# Altium project 2019_10_ELEV_18_IO.PrjPCB
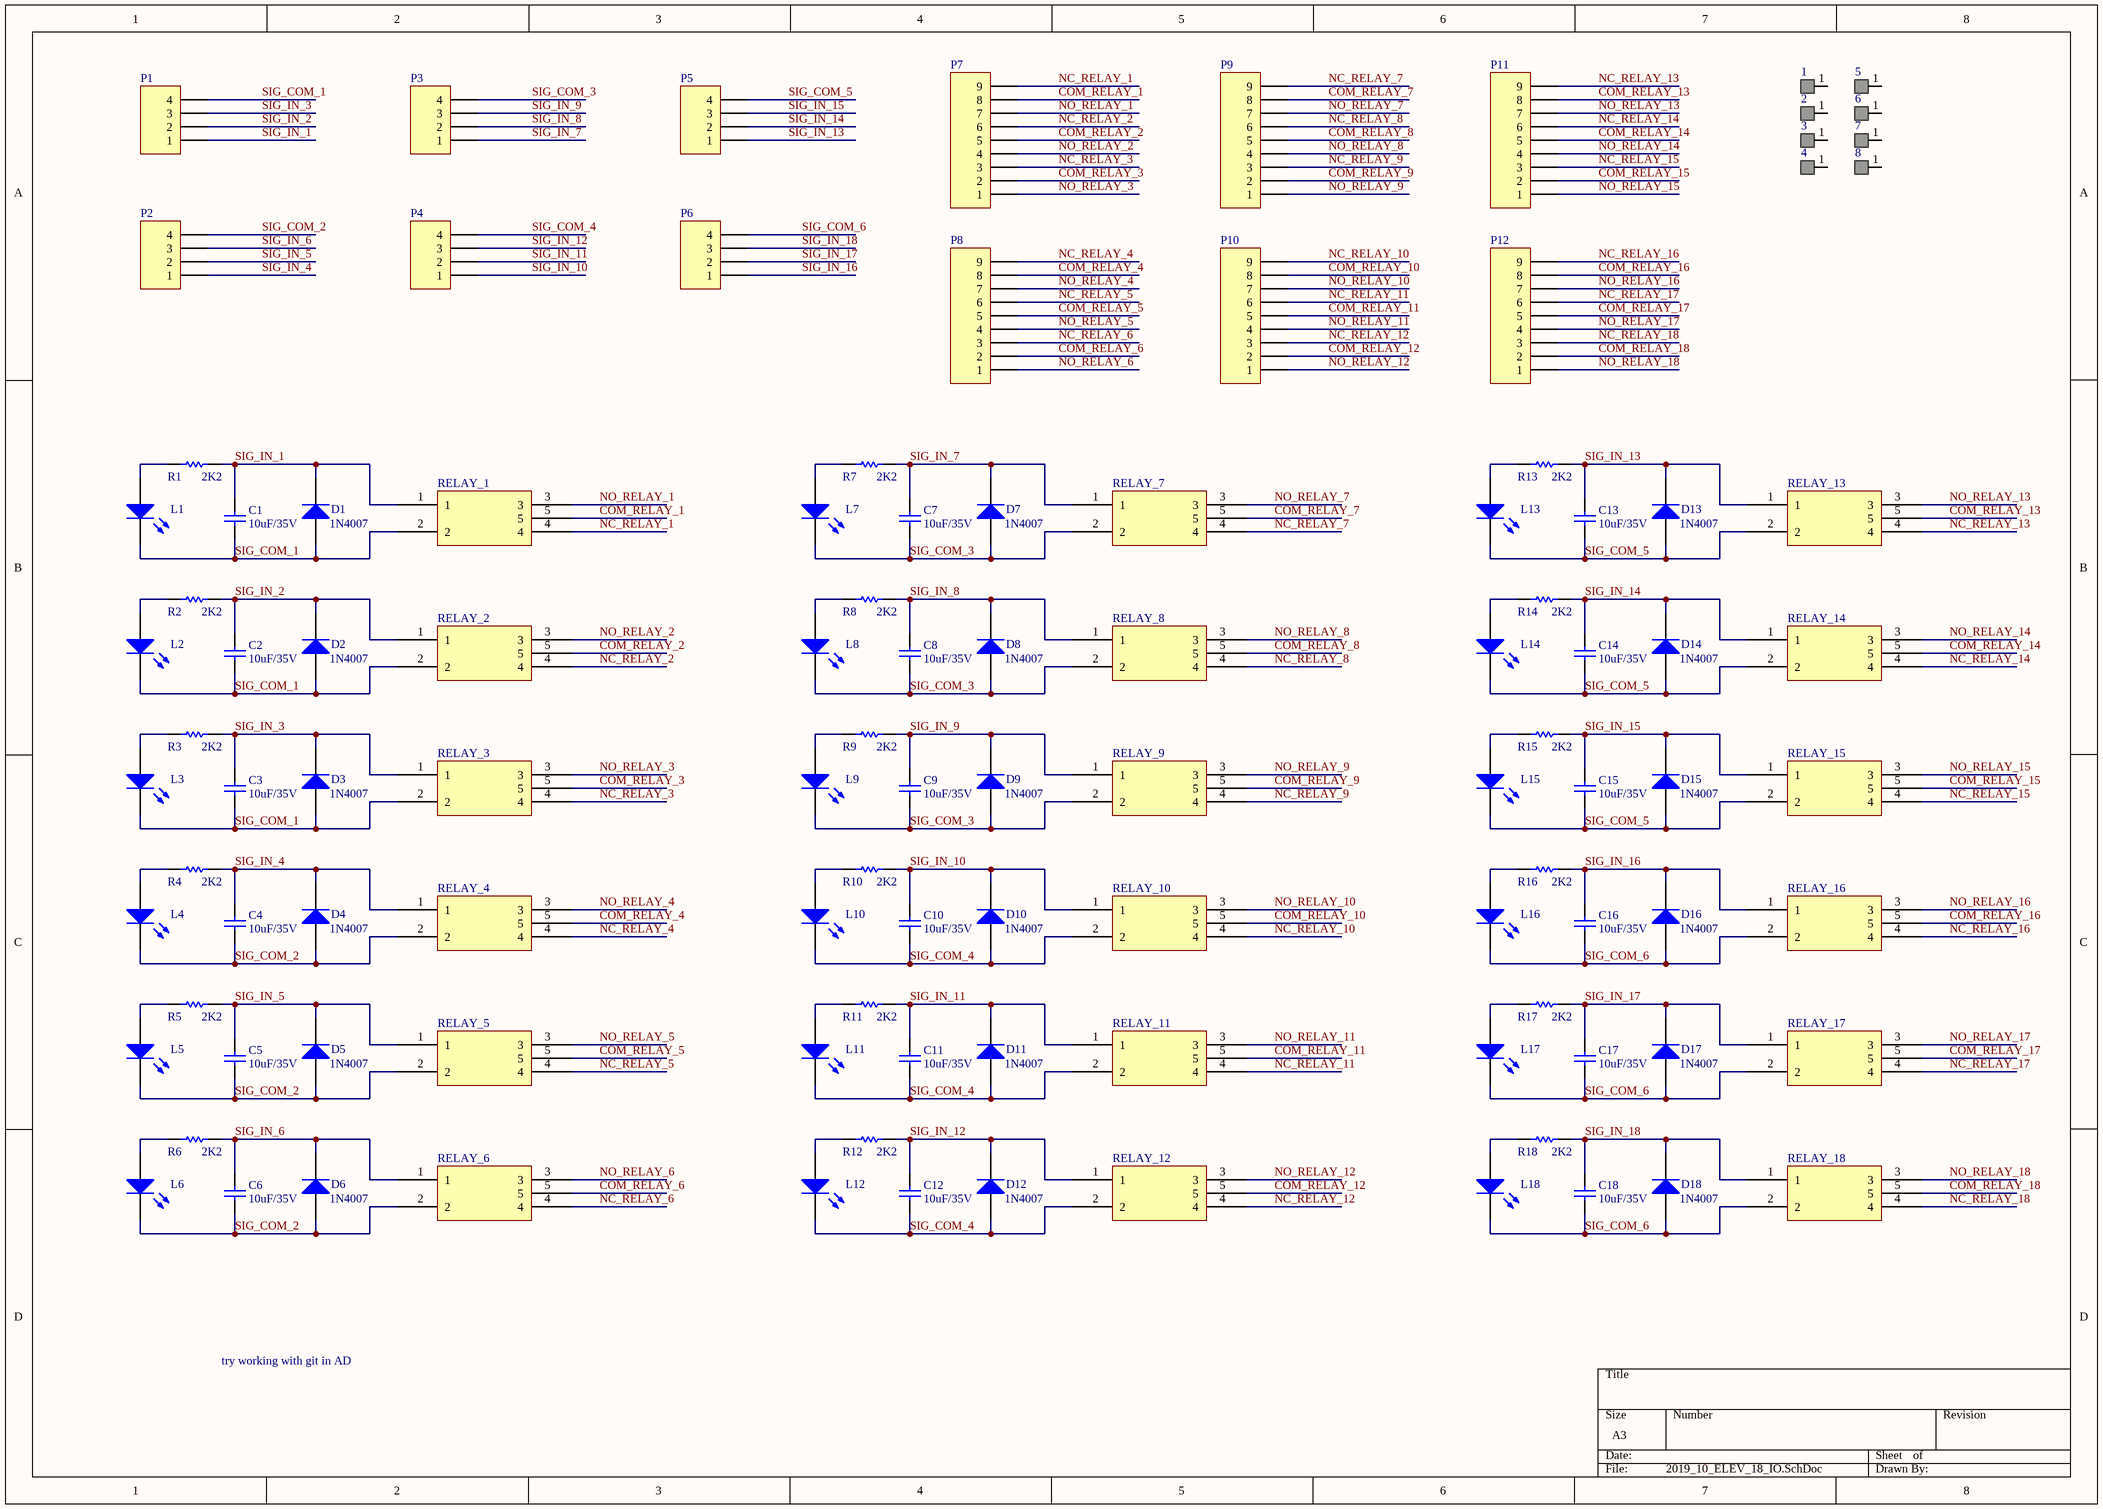
[diagram p0: 2019_10_ELEV_18_IO.SchDoc]
2 sheets, 110 parts. Net scope: global (net labels, ports and power ports of the same name join across sheets).
Board file: 2019_10_ELEV_18_IO.PcbDoc
Sheets:
  2019_10_ELEV_18_IO.SchDoc
  Demo_git_AltiumDesigner.SchDoc

## Sheet 2019_10_ELEV_18_IO.SchDoc
size A3

### Parts
1  LOVIT_1  [VIT]  (value not drawn)
2  LOVIT_1  [VIT]  (value not drawn)
3  LOVIT_1  [VIT]  (value not drawn)
4  LOVIT_1  [VIT]  (value not drawn)
5  LOVIT_1  [VIT]  (value not drawn)
6  LOVIT_1  [VIT]  (value not drawn)
7  LOVIT_1  [VIT]  (value not drawn)
8  LOVIT_1  [VIT]  (value not drawn)
C1  value 10uF/35V  [C1210C106M6PACTU]  (hidden comment: Capacitor)
C2  value 10uF/35V  [C1210C106M6PACTU]  (hidden comment: Capacitor)
C3  value 10uF/35V  [C1210C106M6PACTU]  (hidden comment: Capacitor)
C4  value 10uF/35V  [C1210C106M6PACTU]  (hidden comment: Capacitor)
C5  value 10uF/35V  [C1210C106M6PACTU]  (hidden comment: Capacitor)
C6  value 10uF/35V  [C1210C106M6PACTU]  (hidden comment: Capacitor)
C7  value 10uF/35V  [C1210C106M6PACTU]  (hidden comment: Capacitor)
C8  value 10uF/35V  [C1210C106M6PACTU]  (hidden comment: Capacitor)
C9  value 10uF/35V  [C1210C106M6PACTU]  (hidden comment: Capacitor)
C10  value 10uF/35V  [C1210C106M6PACTU]  (hidden comment: Capacitor)
C11  value 10uF/35V  [C1210C106M6PACTU]  (hidden comment: Capacitor)
C12  value 10uF/35V  [C1210C106M6PACTU]  (hidden comment: Capacitor)
C13  value 10uF/35V  [C1210C106M6PACTU]  (hidden comment: Capacitor)
C14  value 10uF/35V  [C1210C106M6PACTU]  (hidden comment: Capacitor)
C15  value 10uF/35V  [C1210C106M6PACTU]  (hidden comment: Capacitor)
C16  value 10uF/35V  [C1210C106M6PACTU]  (hidden comment: Capacitor)
C17  value 10uF/35V  [C1210C106M6PACTU]  (hidden comment: Capacitor)
C18  value 10uF/35V  [C1210C106M6PACTU]  (hidden comment: Capacitor)
D1  1N4007  [DO-214AC]
D2  1N4007  [DO-214AC]
D3  1N4007  [DO-214AC]
D4  1N4007  [DO-214AC]
D5  1N4007  [DO-214AC]
D6  1N4007  [DO-214AC]
D7  1N4007  [DO-214AC]
D8  1N4007  [DO-214AC]
D9  1N4007  [DO-214AC]
D10  1N4007  [DO-214AC]
D11  1N4007  [DO-214AC]
D12  1N4007  [DO-214AC]
D13  1N4007  [DO-214AC]
D14  1N4007  [DO-214AC]
D15  1N4007  [DO-214AC]
D16  1N4007  [DO-214AC]
D17  1N4007  [DO-214AC]
D18  1N4007  [DO-214AC]
L1  LED0  [LED_3MM]  (value not drawn)
L2  LED0  [LED_3MM]  (value not drawn)
L3  LED0  [LED_3MM]  (value not drawn)
L4  LED0  [LED_3MM]  (value not drawn)
L5  LED0  [LED_3MM]  (value not drawn)
L6  LED0  [LED_3MM]  (value not drawn)
L7  LED0  [LED_3MM]  (value not drawn)
L8  LED0  [LED_3MM]  (value not drawn)
L9  LED0  [LED_3MM]  (value not drawn)
L10  LED0  [LED_3MM]  (value not drawn)
L11  LED0  [LED_3MM]  (value not drawn)
L12  LED0  [LED_3MM]  (value not drawn)
L13  LED0  [LED_3MM]  (value not drawn)
L14  LED0  [LED_3MM]  (value not drawn)
L15  LED0  [LED_3MM]  (value not drawn)
L16  LED0  [LED_3MM]  (value not drawn)
L17  LED0  [LED_3MM]  (value not drawn)
L18  LED0  [LED_3MM]  (value not drawn)
P1  Header 4  [TERMINAL_4PIN_381MM]  (value not drawn)
P2  Header 4  [TERMINAL_4PIN_381MM]  (value not drawn)
P3  Header 4  [TERMINAL_4PIN_381MM]  (value not drawn)
P4  Header 4  [TERMINAL_4PIN_381MM]  (value not drawn)
P5  Header 4  [TERMINAL_4PIN_381MM]  (value not drawn)
P6  Header 4  [TERMINAL_4PIN_381MM]  (value not drawn)
P7  Header 9  [TERMINAL_6PIN_381MM]  (value not drawn)
P8  Header 9  [TERMINAL_6PIN_381MM]  (value not drawn)
P9  Header 9  [TERMINAL_6PIN_381MM]  (value not drawn)
P10  Header 9  [TERMINAL_6PIN_381MM]  (value not drawn)
P11  Header 9  [TERMINAL_6PIN_381MM]  (value not drawn)
P12  Header 9  [TERMINAL_6PIN_381MM]  (value not drawn)
R1  value 2K2  [CRCW080510K0FKEAC]  (hidden comment: Resistor)
R2  value 2K2  [CRCW080510K0FKEAC]  (hidden comment: Resistor)
R3  value 2K2  [CRCW080510K0FKEAC]  (hidden comment: Resistor)
R4  value 2K2  [CRCW080510K0FKEAC]  (hidden comment: Resistor)
R5  value 2K2  [CRCW080510K0FKEAC]  (hidden comment: Resistor)
R6  value 2K2  [CRCW080510K0FKEAC]  (hidden comment: Resistor)
R7  value 2K2  [CRCW080510K0FKEAC]  (hidden comment: Resistor)
R8  value 2K2  [CRCW080510K0FKEAC]  (hidden comment: Resistor)
R9  value 2K2  [CRCW080510K0FKEAC]  (hidden comment: Resistor)
R10  value 2K2  [CRCW080510K0FKEAC]  (hidden comment: Resistor)
R11  value 2K2  [CRCW080510K0FKEAC]  (hidden comment: Resistor)
R12  value 2K2  [CRCW080510K0FKEAC]  (hidden comment: Resistor)
R13  value 2K2  [CRCW080510K0FKEAC]  (hidden comment: Resistor)
R14  value 2K2  [CRCW080510K0FKEAC]  (hidden comment: Resistor)
R15  value 2K2  [CRCW080510K0FKEAC]  (hidden comment: Resistor)
R16  value 2K2  [CRCW080510K0FKEAC]  (hidden comment: Resistor)
R17  value 2K2  [CRCW080510K0FKEAC]  (hidden comment: Resistor)
R18  value 2K2  [CRCW080510K0FKEAC]  (hidden comment: Resistor)
RELAY_1  Component_1  [RELAY_JS1-24V-F]  (value not drawn)
RELAY_2  Component_1  [RELAY_JS1-24V-F]  (value not drawn)
RELAY_3  Component_1  [RELAY_JS1-24V-F]  (value not drawn)
RELAY_4  Component_1  [RELAY_JS1-24V-F]  (value not drawn)
RELAY_5  Component_1  [RELAY_JS1-24V-F]  (value not drawn)
RELAY_6  Component_1  [RELAY_JS1-24V-F]  (value not drawn)
RELAY_7  Component_1  [RELAY_JS1-24V-F]  (value not drawn)
RELAY_8  Component_1  [RELAY_JS1-24V-F]  (value not drawn)
RELAY_9  Component_1  [RELAY_JS1-24V-F]  (value not drawn)
RELAY_10  Component_1  [RELAY_JS1-24V-F]  (value not drawn)
RELAY_11  Component_1  [RELAY_JS1-24V-F]  (value not drawn)
RELAY_12  Component_1  [RELAY_JS1-24V-F]  (value not drawn)
RELAY_13  Component_1  [RELAY_JS1-24V-F]  (value not drawn)
RELAY_14  Component_1  [RELAY_JS1-24V-F]  (value not drawn)
RELAY_15  Component_1  [RELAY_JS1-24V-F]  (value not drawn)
RELAY_16  Component_1  [RELAY_JS1-24V-F]  (value not drawn)
RELAY_17  Component_1  [RELAY_JS1-24V-F]  (value not drawn)
RELAY_18  Component_1  [RELAY_JS1-24V-F]  (value not drawn)

### Nets
COM_RELAY_1: P7.8 RELAY_1.5
COM_RELAY_2: P7.5 RELAY_2.5
COM_RELAY_3: P7.2 RELAY_3.5
COM_RELAY_4: P8.8 RELAY_4.5
COM_RELAY_5: P8.5 RELAY_5.5
COM_RELAY_6: P8.2 RELAY_6.5
COM_RELAY_7: P9.8 RELAY_7.5
COM_RELAY_8: P9.5 RELAY_8.5
COM_RELAY_9: P9.2 RELAY_9.5
COM_RELAY_10: P10.8 RELAY_10.5
COM_RELAY_11: P10.5 RELAY_11.5
COM_RELAY_12: P10.2 RELAY_12.5
COM_RELAY_13: P11.8 RELAY_13.5
COM_RELAY_14: P11.5 RELAY_14.5
COM_RELAY_15: P11.2 RELAY_15.5
COM_RELAY_16: P12.8 RELAY_16.5
COM_RELAY_17: P12.5 RELAY_17.5
COM_RELAY_18: P12.2 RELAY_18.5
NC_RELAY_1: P7.9 RELAY_1.4
NC_RELAY_2: P7.6 RELAY_2.4
NC_RELAY_3: P7.3 RELAY_3.4
NC_RELAY_4: P8.9 RELAY_4.4
NC_RELAY_5: P8.6 RELAY_5.4
NC_RELAY_6: P8.3 RELAY_6.4
NC_RELAY_7: P9.9 RELAY_7.4
NC_RELAY_8: P9.6 RELAY_8.4
NC_RELAY_9: P9.3 RELAY_9.4
NC_RELAY_10: P10.9 RELAY_10.4
NC_RELAY_11: P10.6 RELAY_11.4
NC_RELAY_12: P10.3 RELAY_12.4
NC_RELAY_13: P11.9 RELAY_13.4
NC_RELAY_14: P11.6 RELAY_14.4
NC_RELAY_15: P11.3 RELAY_15.4
NC_RELAY_16: P12.9 RELAY_16.4
NC_RELAY_17: P12.6 RELAY_17.4
NC_RELAY_18: P12.3 RELAY_18.4
NO_RELAY_1: P7.7 RELAY_1.3
NO_RELAY_2: P7.4 RELAY_2.3
NO_RELAY_3: P7.1 RELAY_3.3
NO_RELAY_4: P8.7 RELAY_4.3
NO_RELAY_5: P8.4 RELAY_5.3
NO_RELAY_6: P8.1 RELAY_6.3
NO_RELAY_7: P9.7 RELAY_7.3
NO_RELAY_8: P9.4 RELAY_8.3
NO_RELAY_9: P9.1 RELAY_9.3
NO_RELAY_10: P10.7 RELAY_10.3
NO_RELAY_11: P10.4 RELAY_11.3
NO_RELAY_12: P10.1 RELAY_12.3
NO_RELAY_13: P11.7 RELAY_13.3
NO_RELAY_14: P11.4 RELAY_14.3
NO_RELAY_15: P11.1 RELAY_15.3
NO_RELAY_16: P12.7 RELAY_16.3
NO_RELAY_17: P12.4 RELAY_17.3
NO_RELAY_18: P12.1 RELAY_18.3
SIG_COM_1: C1.2 C2.2 C3.2 D1.1(A) D2.1(A) D3.1(A) L1.2(K) L2.2(K) L3.2(K) P1.4 RELAY_1.2 RELAY_2.2 RELAY_3.2
SIG_COM_2: C4.2 C5.2 C6.2 D4.1(A) D5.1(A) D6.1(A) L4.2(K) L5.2(K) L6.2(K) P2.4 RELAY_4.2 RELAY_5.2 RELAY_6.2
SIG_COM_3: C7.2 C8.2 C9.2 D7.1(A) D8.1(A) D9.1(A) L7.2(K) L8.2(K) L9.2(K) P3.4 RELAY_7.2 RELAY_8.2 RELAY_9.2
SIG_COM_4: C10.2 C11.2 C12.2 D10.1(A) D11.1(A) D12.1(A) L10.2(K) L11.2(K) L12.2(K) P4.4 RELAY_10.2 RELAY_11.2 RELAY_12.2
SIG_COM_5: C13.2 C14.2 C15.2 D13.1(A) D14.1(A) D15.1(A) L13.2(K) L14.2(K) L15.2(K) P5.4 RELAY_13.2 RELAY_14.2 RELAY_15.2
SIG_COM_6: C16.2 C17.2 C18.2 D16.1(A) D17.1(A) D18.1(A) L16.2(K) L17.2(K) L18.2(K) P6.4 RELAY_16.2 RELAY_17.2 RELAY_18.2
SIG_IN_1: C1.1 D1.2(K) P1.1 R1.2 RELAY_1.1
SIG_IN_2: C2.1 D2.2(K) P1.2 R2.2 RELAY_2.1
SIG_IN_3: C3.1 D3.2(K) P1.3 R3.2 RELAY_3.1
SIG_IN_4: C4.1 D4.2(K) P2.1 R4.2 RELAY_4.1
SIG_IN_5: C5.1 D5.2(K) P2.2 R5.2 RELAY_5.1
SIG_IN_6: C6.1 D6.2(K) P2.3 R6.2 RELAY_6.1
SIG_IN_7: C7.1 D7.2(K) P3.1 R7.2 RELAY_7.1
SIG_IN_8: C8.1 D8.2(K) P3.2 R8.2 RELAY_8.1
SIG_IN_9: C9.1 D9.2(K) P3.3 R9.2 RELAY_9.1
SIG_IN_10: C10.1 D10.2(K) P4.1 R10.2 RELAY_10.1
SIG_IN_11: C11.1 D11.2(K) P4.2 R11.2 RELAY_11.1
SIG_IN_12: C12.1 D12.2(K) P4.3 R12.2 RELAY_12.1
SIG_IN_13: C13.1 D13.2(K) P5.1 R13.2 RELAY_13.1
SIG_IN_14: C14.1 D14.2(K) P5.2 R14.2 RELAY_14.1
SIG_IN_15: C15.1 D15.2(K) P5.3 R15.2 RELAY_15.1
SIG_IN_16: C16.1 D16.2(K) P6.1 R16.2 RELAY_16.1
SIG_IN_17: C17.1 D17.2(K) P6.2 R17.2 RELAY_17.1
SIG_IN_18: C18.1 D18.2(K) P6.3 R18.2 RELAY_18.1
NetL1_1: L1.1(A) R1.1
NetL2_1: L2.1(A) R2.1
NetL3_1: L3.1(A) R3.1
NetL4_1: L4.1(A) R4.1
NetL5_1: L5.1(A) R5.1
NetL6_1: L6.1(A) R6.1
NetL7_1: L7.1(A) R7.1
NetL8_1: L8.1(A) R8.1
NetL9_1: L9.1(A) R9.1
NetL10_1: L10.1(A) R10.1
NetL11_1: L11.1(A) R11.1
NetL12_1: L12.1(A) R12.1
NetL13_1: L13.1(A) R13.1
NetL14_1: L14.1(A) R14.1
NetL15_1: L15.1(A) R15.1
NetL16_1: L16.1(A) R16.1
NetL17_1: L17.1(A) R17.1
NetL18_1: L18.1(A) R18.1

Not connected (* = marked no-connect by the designer): 1 1; 2 1; 3 1; 4 1; 5 1; 6 1; 7 1; 8 1

### Notes on the sheet
- try working with git in AD

### Library data of the parts
C1-C18 = C1210C106M6PAC: Multilayer Ceramic Capacitors MLCC - SMD/SMT 35V 10uF X5R 1210 20%; .CheckedSCH: *; .CheckedPCB: *; Supplier 1: Mouser; Supplier Part Number 1: 80-C1210C106M6PAC
D1-D18 = BYG21M-E3/TR: Diode Rectifiers 1.5 Amp 1000 Volt; Supplier 1: Mouser; .CheckedSCH: *; .CheckedPCB: *; Supplier Part Number 1: 625-BYG21M-E3
L1-L18 = LED0: Typical INFRARED GaAs LED; Published: 8-Jun-2000; LatestRevisionDate: 08-Jul-2005; LatestRevisionNote: Mech Layer 1 removed.; PackageReference: LED-0; Publisher: Altium Limited; PackageDescription: LED; 2 Leads
P1-P6 = Header 4: Header, 4-Pin; LatestRevisionDate: 17-Jul-2002; LatestRevisionNote: Re-released for DXP Platform.; Publisher: Altium Limited
P7-P12 = Header 9: Header, 9-Pin; LatestRevisionDate: 17-Jul-2002; LatestRevisionNote: Re-released for DXP Platform.; Publisher: Altium Limited
R1-R18 = RC0805JR-131KL: Thick Film Resistors - SMD 1K OHM 5%; Supplier 1: Mouser; Supplier Part Number 1: 603-RC0805JR-131KL; .CheckedSCH: *; .CheckedPCB: *

## Sheet Demo_git_AltiumDesigner.SchDoc
size A4
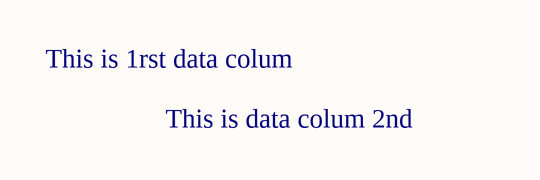
[diagram p1: Demo_git_AltiumDesigner.SchDoc]

### Notes on the sheet
- This is 1rst data colum
- This is data colum 2nd